# Altium project IoT_v2.PrjPcb
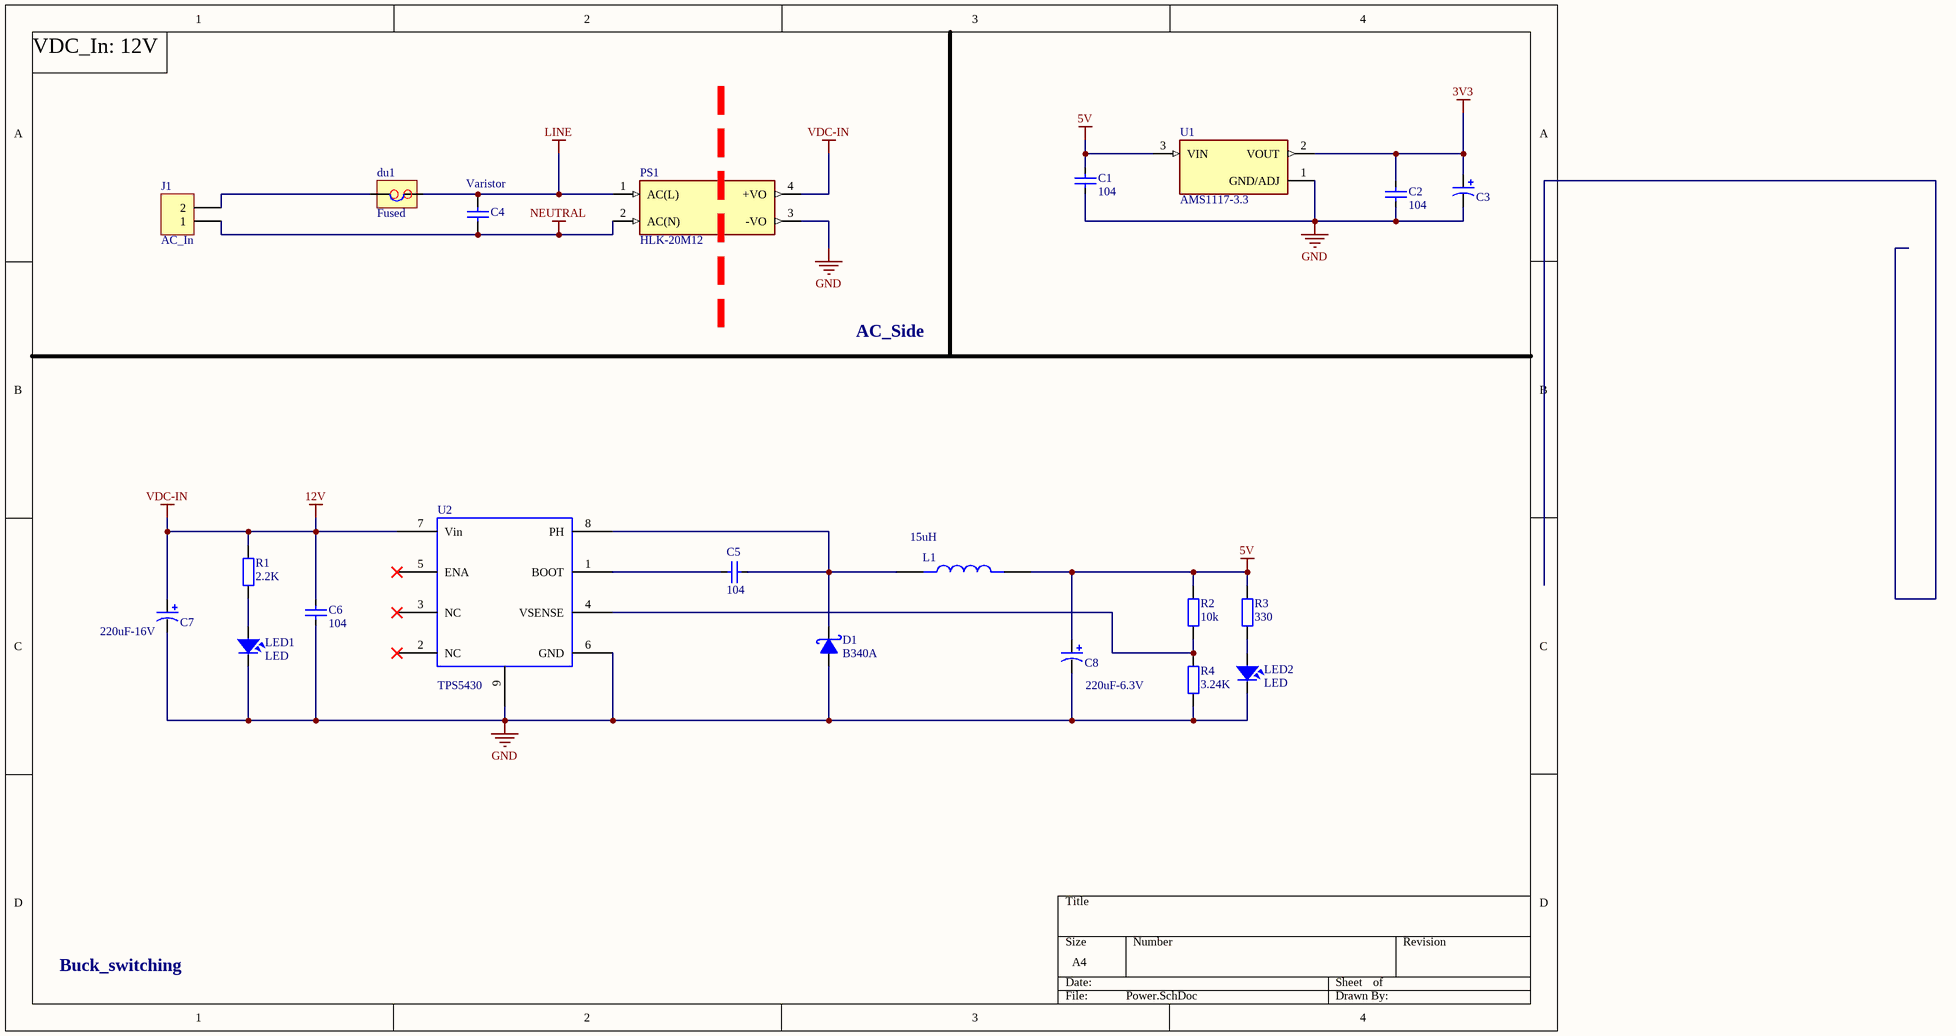
[diagram p0: Power.SchDoc]
4 sheets, 69 parts. Net scope: global (net labels, ports and power ports of the same name join across sheets).
Board file: IOT_v2.PcbDoc
Sheets:
  Power.SchDoc
  Driver.SchDoc
  MCU.SchDoc
  Sensor.SchDoc

## Sheet Power.SchDoc
size A4; SheetNumber: 1; SheetTotal: 4

### Parts
C1  104  [CAP_0805]
C2  104  [CAP_0805]
C3  100uF  [CAP_7343]  (value not drawn)
C4  Varistor  [CAP_MICA_6MM]
C5  104  [CAP_0805]
C6  104  [CAP_0805]
C7  220uF-16V  [CAP_7343]
C8  220uF-6.3V  [CAP_7343]
D1  B340A  [SMA]
du1  Fused  [FUSRR1015W52L1650T300H2620]
J1  AC_In  [KF2-5.08T]
L1  15uH  [IND_ASPI-0630LR-150M-T15]
LED1  LED  [LED-0805-Blue]
LED2  LED  [LED-0805-Blue]
PS1  HLK-20M12  [CONV_HLK-20M12]
R1  2.2K  [RES-SMD-0805]
R2  10k  [RES-SMD-0805]
R3  330  [RES-SMD-0805]
R4  3.24K  [RES-SMD-0805]
U1  AMS1117-3.3  [SOT229P700X180-4N]
U2  TPS5430  [TPS5430-2]

### Nets
3V3: C2.1 C3.1 U1.2(VOUT)
5V: C1.1 C8.1 L1.2 R2.2 R3.2 U1.3(VIN)
12V: C6.1 C7.1 PS1.4(+VO) R1.2 U2.7(Vin)  [also labelled VDC-IN]
GND: C1.2 C2.2 C3.2 C6.2 C7.2 C8.2 D1.1(A) LED1.2 LED2.2 PS1.3(-VO) R4.1 U1.1(GND/ADJ) U2.6(GND) U2.9(PWR_PAD)
LINE: C4.1 du1.2 PS1.1(AC(L))  [project net COM1]
NEUTRAL: C4.2 J1.1 PS1.2(AC(N))
NetC5_1: C5.1 U2.1(BOOT)
NetC5_2: C5.2 D1.2(K) L1.1 U2.8(PH)
Netdu1_1: du1.1 J1.2
NetLED1_1: LED1.1 R1.1
NetLED2_1: LED2.1 R3.1
NetR2_1: R2.1 R4.2 U2.4(VSENSE)

Not connected (* = marked no-connect by the designer): U2 2(NC)* 3(NC)* 5(ENA)*

### Notes on the sheet
- VDC_In: 12V
- AC_Side
- Buck_switching

### Library data of the parts
C1 C2 = CapSMD: Capacitor; Value: 33p; Published: 8-Jun-2000; LatestRevisionDate: 17-Jul-2002; LatestRevisionNote: Re-released for DXP Platform.; PackageReference: RAD-0.3; Publisher: Altium Limited
C3 = CAP_TAN_SMD: https://linhkien.cxt.vn/8805-tu-tantalum-100uf-63v-7343-73x43mm.html
C4 = CapCeramic: 10D561K; Value: 33p; Published: 8-Jun-2000; LatestRevisionDate: 17-Jul-2002; LatestRevisionNote: Re-released for DXP Platform.; PackageReference: RAD-0.3; Publisher: Altium Limited
C5 C6 = CapSMD: https://linhkien.cxt.vn/9232-tu-104-01uf-100nf-0805-25v-10-10c.html; Value: 33p; Published: 8-Jun-2000; LatestRevisionDate: 17-Jul-2002; LatestRevisionNote: Re-released for DXP Platform.; PackageReference: RAD-0.3; Publisher: Altium Limited
C7 C8 = CAP_TAN_SMD: https://linhkien.cxt.vn/2032-tu-tantalum-7343-cac-gia-tri.html
D1 = Diode Schottky: https://linhkien.cxt.vn/4563-b340a-13-f-diode-schottky-3a-40v-smado-214ac.html
du1 = FuseNote2
J1 = KF2: Manufacturer: Würth Elektronik eiSos GmbH; partNo: 691103110002; ComponentLink1 Description: Manufacturer; ComponentLink2 Description: Datasheet; NoPins: 2; Created Date: 29 October 2013; ComponentLink1URL: http://www.we-online.com; ComponentLink2URL: http://katalog.we-online.de/em/datasheet/6911031100xx.pdf; Created by: Karrer Zheng
L1 = ASPI-0630LR-150M-T15: https://linhkien.cxt.vn/3445-cuon-cam-150-15uh-0630-3a-7x7x3mm.html; MF: Abracon LLC; Check_prices: https://www.snapeda.com/parts/ASPI-0630LR-150M-T15/Abracon+LLC/view-part/?ref=eda; Digi-Key_Part_Number: ASPI-0630LR-150M-T15TR-ND; Value: *; SnapEDA_Link: https://www.snapeda.com/parts/ASPI-0630LR-150M-T15/Abracon+LLC/view-part/?ref=snap; Package: Nonstandard Abracon LLC; MP: ASPI-0630LR-150M-T15; Purchase-URL: https://pricing.snapeda.com/search/part/ASPI-0630LR-150M-T15/?ref=eda
LED1 LED2 = LED: LED Single colour Green and Red; Value: LED 3 ly Single Colour
PS1 = HLK-20M12: 20W ultra-small series module power supply; MF: Hi-link; Check_prices: https://www.snapeda.com/parts/HLK-20M12/Hi-link/view-part/?ref=eda; SnapEDA_Link: https://www.snapeda.com/parts/HLK-20M12/Hi-link/view-part/?ref=snap; Availability: Not in stock; Price: None; Value: *; MP: HLK-20M12; Package: Non-Standard Hi-link
R1 = Resistor - SMD: https://linhkien.cxt.vn/5089-dien-tro-0805-1-thong-so-tu-1k-den-91k.html; Manufacturer: Generic Components; Class: Passive; Published: 08/06/2000; Publisher: Altium Hobart Technology Centre
R2 = Resistor - SMD: https://linhkien.cxt.vn/6741-dien-tro-0805-1-thong-so-tu-1k-den-91k.html; Manufacturer: Generic Components; Class: Passive; Published: 08/06/2000; Publisher: Altium Hobart Technology Centre
R3 = Resistor - SMD: https://linhkien.cxt.vn/2346-dien-tro-0805-1-thong-so-tu-1k-den-91k.html; Manufacturer: Generic Components; Class: Passive; Published: 08/06/2000; Publisher: Altium Hobart Technology Centre
R4 = Resistor - SMD: https://linhkien.cxt.vn/6162-dien-tro-59k-0805-1-50c.html; Manufacturer: Generic Components; Class: Passive; Published: 08/06/2000; Publisher: Altium Hobart Technology Centre
U1 = AMS1117-3.3: Sot223/Pkg 1-Amp 3.3-Volt Low Drop Out Voltage Regulatator; MF: Advanced Monolithic Systems; Package: SOT-223 Seeed Technology; Value: *; Check_prices: https://www.snapeda.com/parts/AMS1117-3.3/Advanced+Monolithic+Systems/view-part/?ref=eda; Price: None; Availability: Not in stock; MP: AMS1117-3.3; SnapEDA_Link: https://www.snapeda.com/parts/AMS1117-3.3/Advanced+Monolithic+Systems/view-part/?ref=snap
U2 = TPS5430: https://linhkien.cxt.vn/7312-tps54302ddct-ic-reg-buck-adj-3a-tsot23-6.html; Name: TPS5430

## Sheet Driver.SchDoc
size A4; SheetNumber: 2; SheetTotal: 4
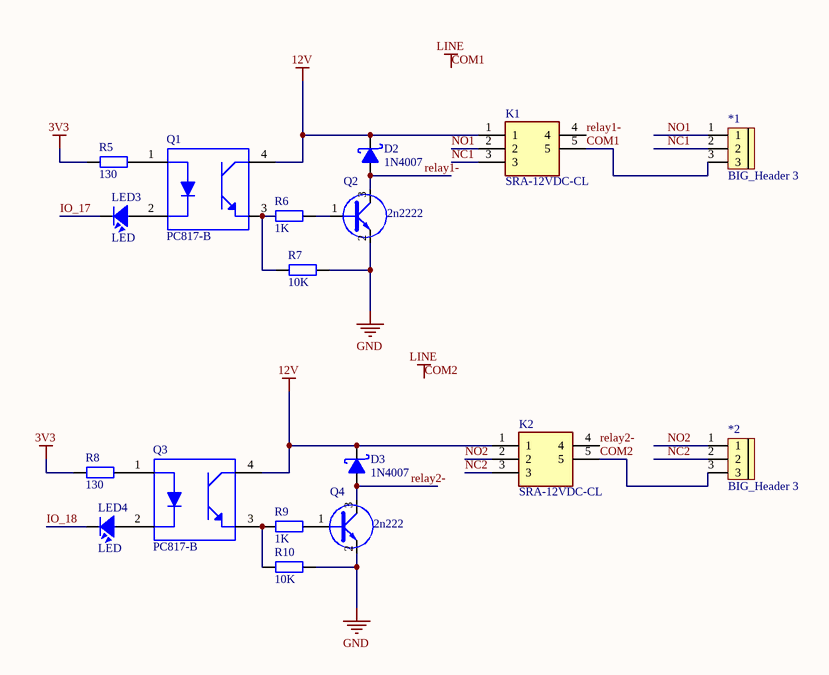
[diagram p1: Driver.SchDoc]

### Parts
*1  BIG_Header 3  [KF-128_3P]
*2  BIG_Header 3  [KF-128_3P]
D2  1N4007  [SMA]
D3  1N4007  [SMA]
K1  SRA-12VDC-CL  [SRA12VDCCL]
K2  SRA-12VDC-CL  [SRA12VDCCL]
LED3  LED  [LED-0805-Green]
LED4  LED  [LED-0805-Green]
Q1  PC817-B  [DIP4/W0.3]
Q2  2n2222  [SOT23]
Q3  PC817-B  [DIP4/W0.3]
Q4  2n222  [SOT23]
R5  130  [RES-SMD-0805]
R6  1K  [RES-SMD-0805]
R7  10K  [RES-SMD-0805]
R8  130  [RES-SMD-0805]
R9  1K  [RES-SMD-0805]
R10  10K  [RES-SMD-0805]

### Nets
3V3: R5.2 R8.2
12V: D2.2(K) D3.2(K) K1.1 K2.1 Q1.4(COLLECTOR) Q3.4(COLLECTOR)
COM1: *1.3 *2.3 K1.5 K2.5  [also labelled COM2, LINE]
GND: Q2.2(E) Q4.2(E) R7.1 R10.1
IO_17: LED3.2
IO_18: LED4.2
NC1: *1.2 K1.3
NC2: *2.2 K2.3
NO1: *1.1 K1.2
NO2: *2.1 K2.2
relay1-: D2.1(A) K1.4 Q2.3(C)
relay2-: D3.1(A) K2.4 Q4.3(C)
NetLED3_1: LED3.1 Q1.2(CATHODE)
NetLED4_1: LED4.1 Q3.2(CATHODE)
NetQ1_1: Q1.1(ANODE) R5.1
NetQ1_3: Q1.3(EMITTER) R6.2 R7.2
NetQ2_1: Q2.1(B) R6.1
NetQ3_1: Q3.1(ANODE) R8.1
NetQ3_3: Q3.3(EMITTER) R9.2 R10.2
NetQ4_1: Q4.1(B) R9.1

### Library data of the parts
D2 D3 = 1N5822: https://linhkien.cxt.vn/1119-1n4007-m7-diode-chinh-luu-1a-1000v-smado-214ac-10c.html; Value: Diode c?m 1N5408
K1 K2 = SRA-12VDC-CL: https://linhkien.cxt.vn/3210-sra-12vdc-cl-songle-relay-20a-12vdc-5-chan.html; Manufacturer_Name: Songle Relay; Height: 14mm; Manufacturer_Part_Number: SRA-12VDC-CL
LED3 LED4 = LED: as LED1 on sheet Power
Q1 Q3 = PC817-B: https://linhkien.cxt.vn/10328-pc817-dip4.html; MF: American Bright; SnapEDA_Link: https://www.snapeda.com/parts/PC817-B/American%20Bright/view-part/524587/?ref=snap; Availability: Unavailable; MP: PC817-B; Value: *; Price: None; Package: DIP-4 American Bright
Q2 Q4 = C1815: https://linhkien.cxt.vn/2040-2n2222-1p-npn-transistor-600ma-40v-sot-23-10c.html; Value: C1815
R5 R8 = Resistor - SMD: https://linhkien.cxt.vn/2109-dien-tro-130r-0805-5-50c.html; Manufacturer: Generic Components; Class: Passive; Published: 08/06/2000; Publisher: Altium Hobart Technology Centre
R6 R9 = Resistor - SMD: https://linhkien.cxt.vn/6152-dien-tro-174k-0805-1-50c.html; Manufacturer: Generic Components; Class: Passive; Published: 08/06/2000; Publisher: Altium Hobart Technology Centre
R7 = Resistor - SMD: Resistor SMD; Manufacturer: Generic Components; Class: Passive; Published: 08/06/2000; Publisher: Altium Hobart Technology Centre
R10 = Resistor - SMD: 17.4K; Manufacturer: Generic Components; Class: Passive; Published: 08/06/2000; Publisher: Altium Hobart Technology Centre

## Sheet MCU.SchDoc
size A4; SheetNumber: 3; SheetTotal: 4
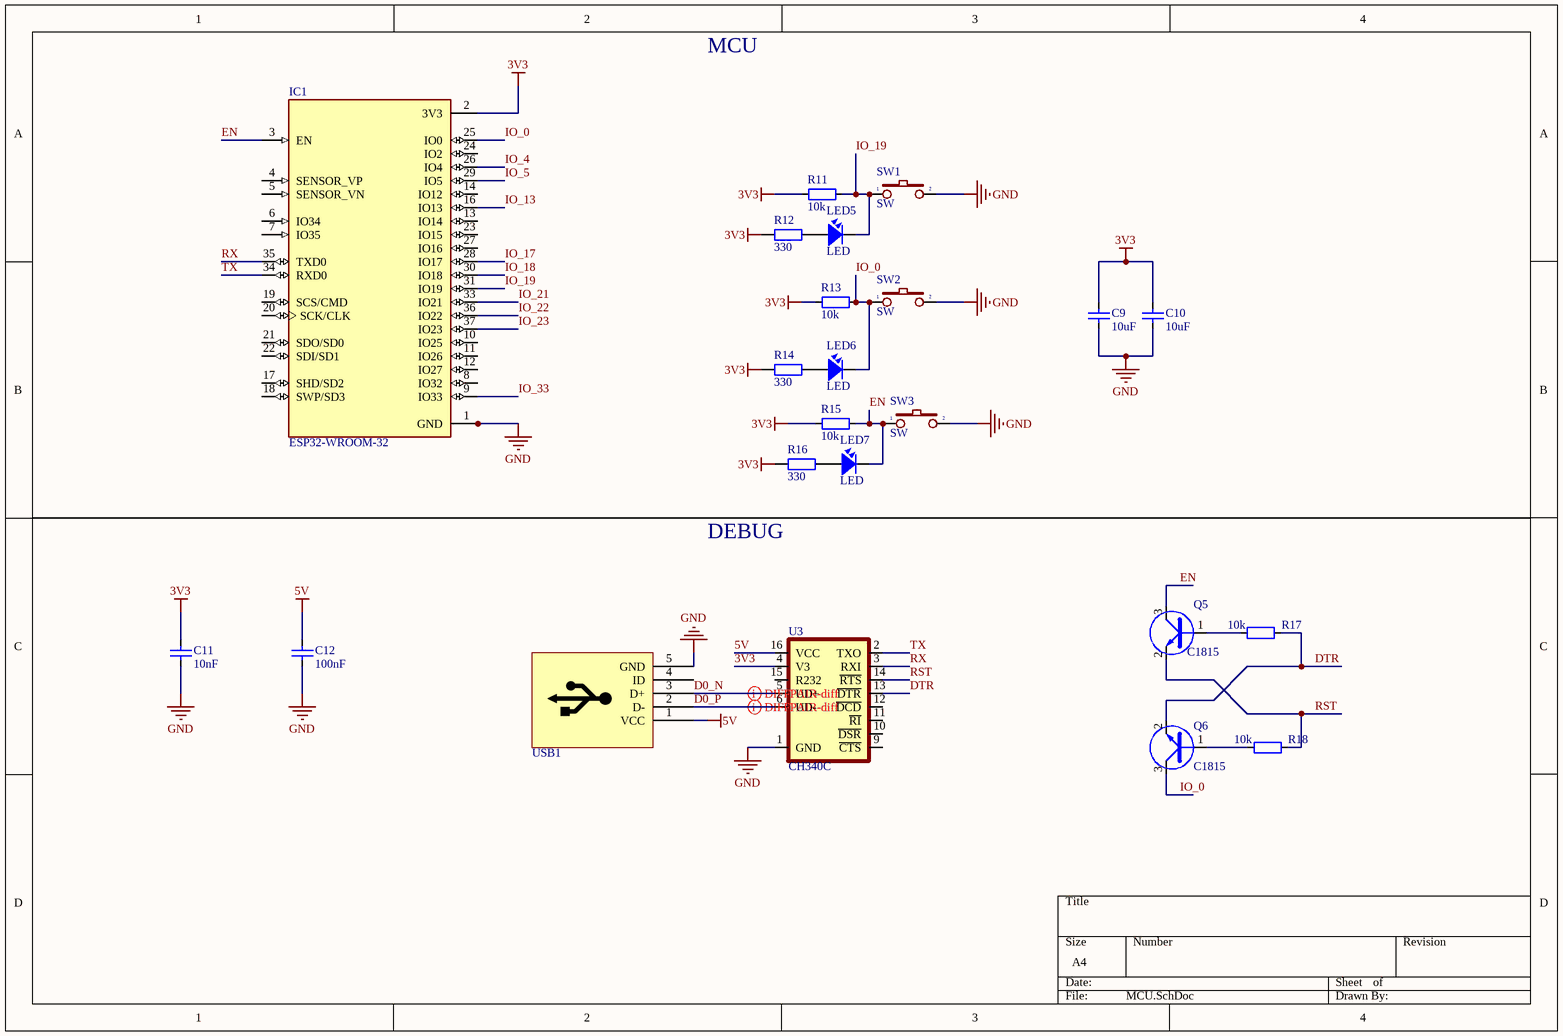
[diagram p2: MCU.SchDoc]

### Parts
C9  10uF  [CAP_0805]
C10  10uF  [CAP_0805]
C11  10nF  [CAP_0805]
C12  100nF  [CAP_0805]
IC1  ESP32-WROOM-32  [MODULE_ESP32-WROOM-32]
LED5  LED  [LED-0805-Blue]
LED6  LED  [LED-0805-Blue]
LED7  LED  [LED-0805-Blue]
Q5  C1815  [SOT23D]
Q6  C1815  [SOT23D]
R11  10k  [RES-SMD-0805]
R12  330  [RES-SMD-0805]
R13  10k  [RES-SMD-0805]
R14  330  [RES-SMD-0805]
R15  10k  [RES-SMD-0805]
R16  330  [RES-SMD-0805]
R17  10k  [RES-SMD-0805]
R18  10k  [RES-SMD-0805]
SW1  SW  [BUTTON_2_SMD]
SW2  SW  [SW_B3U-1000P]
SW3  SW  [SW_B3U-1000P]
U3  CH340C  [SOP-16]
USB1  USB  [USB-M1]  (value not drawn)

### Nets
3V3: C9.1 C10.1 C11.1 IC1.2(3V3) R11.2 R12.2 R13.2 R14.2 R15.2 R16.2 U3.4(V3)
5V: C12.1 U3.16(VCC) USB1.1(VCC)
GND: C9.2 C10.2 C11.2 C12.2 IC1.1(GND) IC1.15(GND) IC1.38(GND) IC1.39_1(GND) IC1.39_2(GND) IC1.39_3(GND) IC1.39_4(GND) IC1.39_5(GND) IC1.39_6(GND) IC1.39_7(GND) IC1.39_8(GND) IC1.39_9(GND) IC1.39_10(GND) IC1.39_11(GND) IC1.39_12(GND) IC1.39_13(GND) IC1.39_14(GND) IC1.39_15(GND) IC1.39_16(GND) IC1.39_17(GND) IC1.39_18(GND) IC1.39_19(GND) IC1.39_20(GND) IC1.39_21(GND) SW1.2 SW2.2 SW3.2 U3.1(GND) USB1.5(GND)
D0_N: U3.5(UD+) USB1.3(D+)
D0_P: U3.6(UD-) USB1.2(D-)
DTR: Q6.2(E) R17.1 U3.13(~{DTR})
EN: IC1.3(EN) LED7.2 Q5.3(C) R15.1 SW3.1
IO_0: IC1.25(IO0) LED6.2 Q6.3(C) R13.1 SW2.1
IO_4: IC1.26(IO4)
IO_5: IC1.29(IO5)
IO_13: IC1.16(IO13)
IO_17: IC1.28(IO17)
IO_18: IC1.30(IO18)
IO_19: IC1.31(IO19) LED5.2 R11.1 SW1.1
IO_21: IC1.33(IO21)
IO_22: IC1.36(IO22)
IO_23: IC1.37(IO23)
IO_33: IC1.9(IO33)
RST: Q5.2(E) R18.1 U3.14(~{RTS})
RX: IC1.35(TXD0) U3.3(RXI)
TX: IC1.34(RXD0) U3.2(TXO)
NetLED5_1: LED5.1 R12.1
NetLED6_1: LED6.1 R14.1
NetLED7_1: LED7.1 R16.1
NetQ5_1: Q5.1(B) R17.2
NetQ6_1: Q6.1(B) R18.2

Not connected (* = marked no-connect by the designer): IC1 4(SENSOR_VP) 5(SENSOR_VN) 6(IO34) 7(IO35) 8(IO32) 10(IO25) 11(IO26) 12(IO27) 13(IO14) 14(IO12) 17(SHD/SD2) 18(SWP/SD3) 19(SCS/CMD) 20(SCK/CLK) 21(SDO/SD0) 22(SDI/SD1) 23(IO15) 24(IO2) 27(IO16); U3 9(~{CTS}) 10(~{DSR}) 11(~{RI}) 12(~{DCD}) 15(R232); USB1 4(ID)

### Layout directives
differential pair; differential pair class diff: D0_N, D0_P

### Notes on the sheet
- MCU
- DEBUG

### Library data of the parts
C9-C12 = CapSMD: Capacitor; Value: 33p; Published: 8-Jun-2000; LatestRevisionDate: 17-Jul-2002; LatestRevisionNote: Re-released for DXP Platform.; PackageReference: RAD-0.3; Publisher: Altium Limited
IC1 = ESP32-WROOM-32: Bluetooth, WiFi Transceiver Module 2.4GHz ~ 2.5GHz Surface Mount; MF: Espressif Systems; Package: Module Espressif Systems; Digi-Key_Part_Number: 1904-1010-1-ND; Digi-Key_Purchase_URL: https://www.digikey.com/product-detail/en/espressif-systems/ESP32-WROOM-32/1904-1010-1-ND/8544305?utm_source=snapeda&utm_medium=aggregator&utm_campaign=symbol; Value: *; MP: ESP32-WROOM-32; SnapEDA_Link: https://www.snapeda.com/parts/ESP32-WROOM-32/Espressif%20Systems/view-part/2753322/?ref=snap
LED5-LED7 = LED: as LED1 on sheet Power
Q5 Q6 = 2SC1815: NPN 600mW, ECB; Value: C1815
R11 R13 R15 R17 R18 = Resistor - SMD: Resistor; Manufacturer: Generic Components; Class: Passive; Published: 08/06/2000; Publisher: Altium Hobart Technology Centre
R12 R14 R16 = Resistor - SMD: as R7 on sheet Driver; Published: 08/06/2000; Publisher: Altium Hobart Technology Centre
SW1-SW3 = SW2: https://linhkien.cxt.vn/1779-nut-nhan-smd-2p.html; Value: SW chip 2 pin
U3 = CH340C: https://linhkien.cxt.vn/4690-ch340c-ic-transceiver-2mbps-usb20-sop-16.html; MF: WCH; Package: Package; Check_prices: https://www.snapeda.com/parts/CH340C/WCH/view-part/5428851/?ref=eda; Value: *; Price: None; MP: CH340C; Availability: Unavailable; SnapEDA_Link: https://www.snapeda.com/parts/CH340C/WCH/view-part/5428851/?ref=snap
USB1 = USB-M

## Sheet Sensor.SchDoc
size A4; SheetNumber: 4; SheetTotal: 4
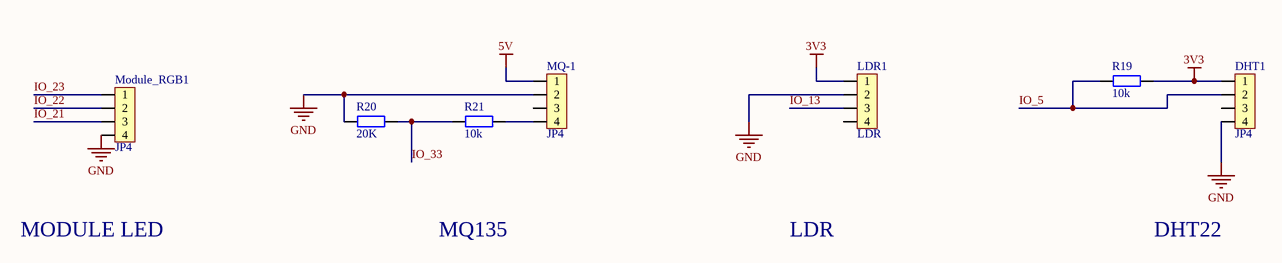
[diagram p3: Sensor.SchDoc]

### Parts
DHT1  JP4  [JP4-C1T]
LDR1  LDR  [JP4-C1T]
Module_RGB1  JP4  [JP4-C1T]
MQ-1  JP4  [JP4-C1T]
R19  10k  [RES-SMD-0805]
R20  20K  [RES-SMD-0805]
R21  10k  [RES-SMD-0805]

### Nets
3V3: DHT1.1 LDR1.1 R19.1
5V: MQ-1.1
GND: DHT1.4 LDR1.2 Module_RGB1.4 MQ-1.2 R20.1
IO_5: DHT1.2 R19.2
IO_13: LDR1.3
IO_21: Module_RGB1.3
IO_22: Module_RGB1.2
IO_23: Module_RGB1.1
IO_33: R20.2 R21.1
NetMQ-1_4: MQ-1.4 R21.2

Not connected (* = marked no-connect by the designer): DHT1 3; LDR1 4; MQ-1 3

### Notes on the sheet
- MODULE LED
- MQ135
- LDR
- DHT22

### Library data of the parts
DHT1 LDR1 MQ-1 = JP4: https://linhkien.cxt.vn/1788-header-duc-3p-xh254-3p-chan-thang-10c.html; Manufacturer: W¨¹rth Elektronik eiSos GmbH; partNo: 613004143121; ComponentLink1 Description: Manufacturer; ComponentLink2 Description: Datasheet; NoPins: 04; Created Date: 29 March 2013; ComponentLink1URL: http://www.we-online.com; ComponentLink2URL: http://katalog.we-online.de/em/datasheet/6130xx143121.pdf; Created by: Karrer Zheng
Module_RGB1 = JP4: https://linhkien.cxt.vn/1789-header-duc-254-chan-thang.html / https://shopee.vn/Module-Led-RGB-5050-i.90668226.3044531135; Manufacturer: W¨¹rth Elektronik eiSos GmbH; partNo: 613004143121; ComponentLink1 Description: Manufacturer; ComponentLink2 Description: Datasheet; NoPins: 04; Created Date: 29 March 2013; ComponentLink1URL: http://www.we-online.com; ComponentLink2URL: http://katalog.we-online.de/em/datasheet/6130xx143121.pdf; Created by: Karrer Zheng
R19 = Resistor - SMD: 1k; Manufacturer: Generic Components; Class: Passive; Published: 08/06/2000; Publisher: Altium Hobart Technology Centre
R20 R21 = Resistor - SMD: Manufacturer: Generic Components; Class: Passive; Published: 08/06/2000; Publisher: Altium Hobart Technology Centre

## Nets that join several sheets
3V3: Power (C2.1 C3.1 U1.2), Driver (R5.2 R8.2), MCU (11 pins), Sensor (DHT1.1 LDR1.1 R19.1)
5V: Power (6 pins), MCU (C12.1 U3.16 USB1.1), Sensor (MQ-1.1)
12V: Power (5 pins), Driver (6 pins)
COM1: Power (C4.1 du1.2 PS1.1), Driver (*1.3 *2.3 K1.5 K2.5)
GND: Power (14 pins), Driver (Q2.2 Q4.2 R7.1 R10.1), MCU (33 pins), Sensor (5 pins)
IO_5: MCU (IC1.29), Sensor (DHT1.2 R19.2)
IO_13: MCU (IC1.16), Sensor (LDR1.3)
IO_17: Driver (LED3.2), MCU (IC1.28)
IO_18: Driver (LED4.2), MCU (IC1.30)
IO_21: MCU (IC1.33), Sensor (Module_RGB1.3)
IO_22: MCU (IC1.36), Sensor (Module_RGB1.2)
IO_23: MCU (IC1.37), Sensor (Module_RGB1.1)
IO_33: MCU (IC1.9), Sensor (R20.2 R21.1)